# EAGLE design FreeVario F4 V1.2 (EAGLE 9.2.2)
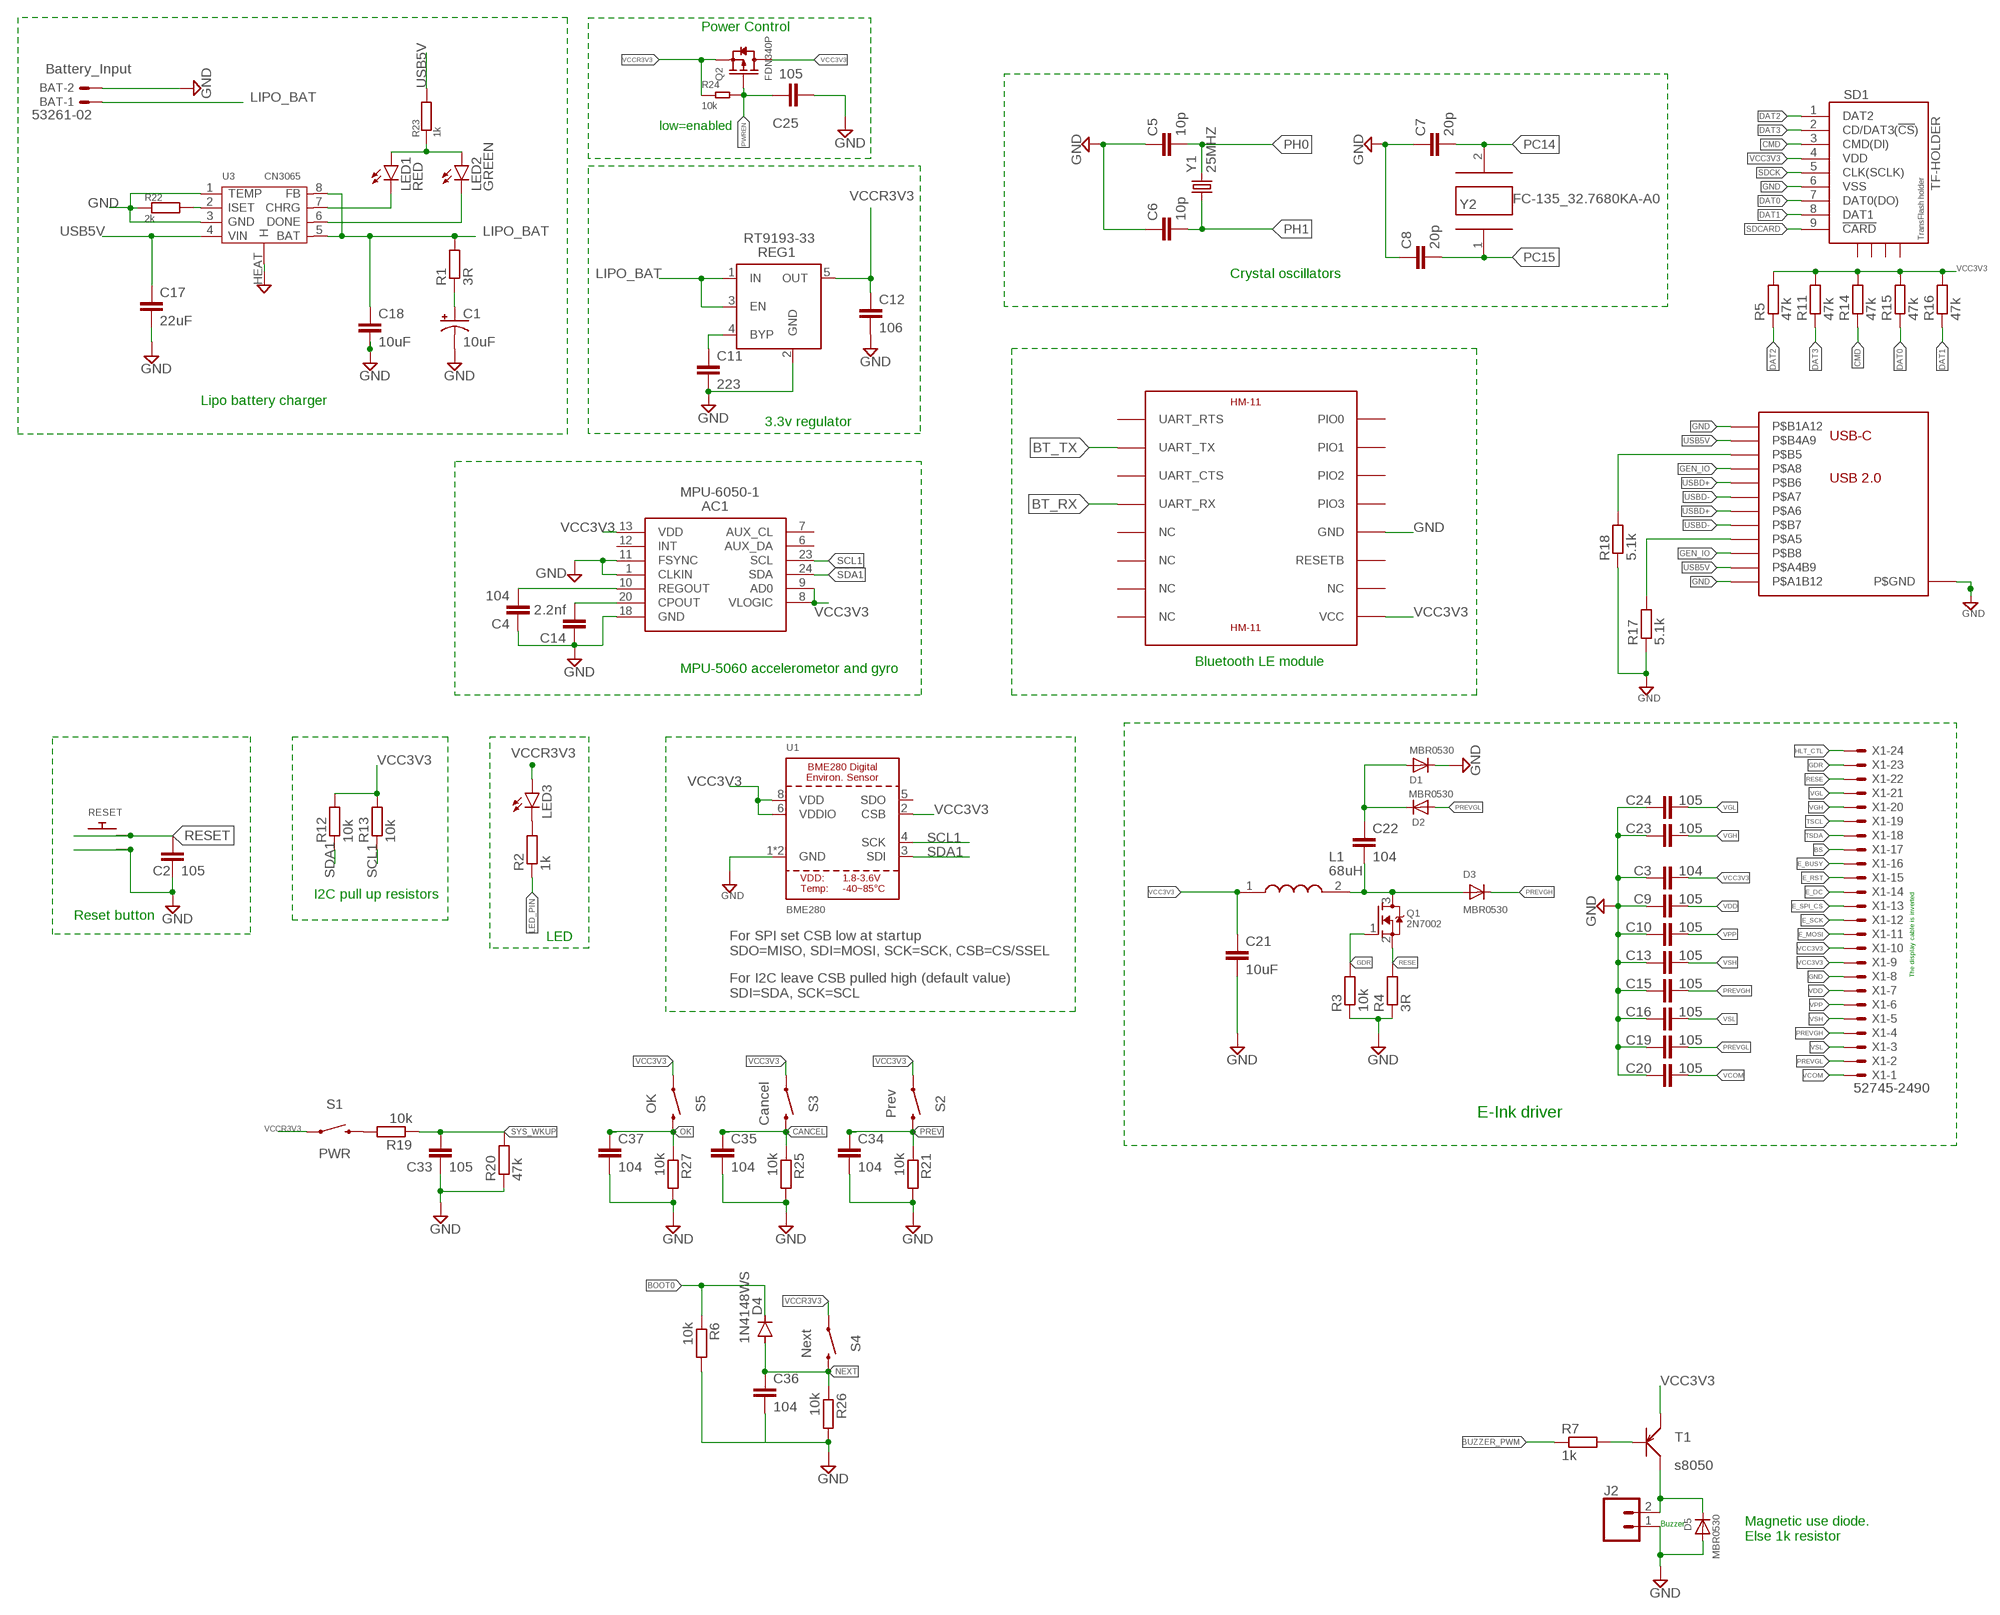
[diagram p0: schematic, sheet 1, part 1 of 2]
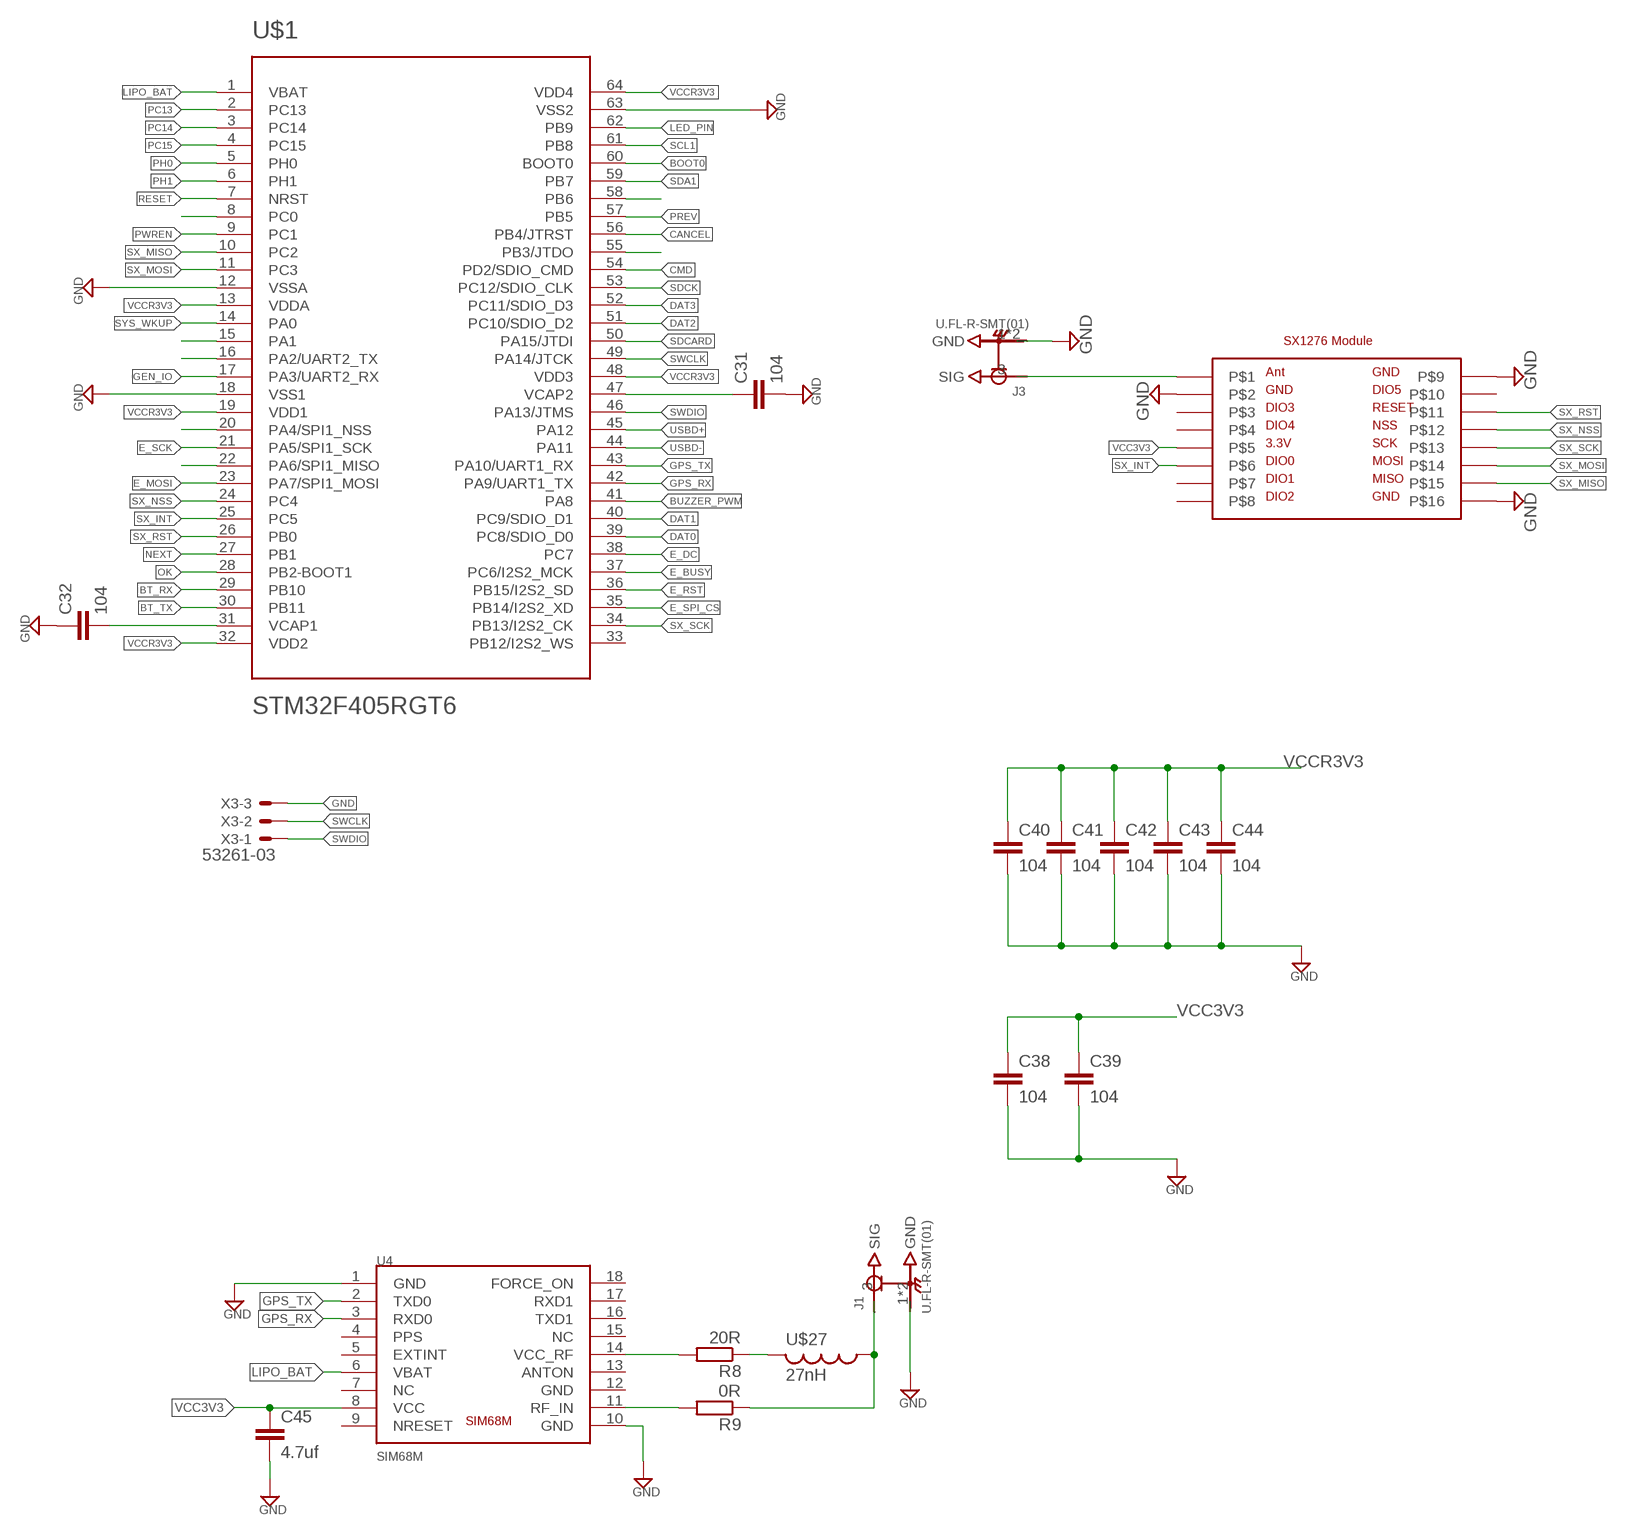
[diagram p1: schematic, sheet 1, part 2 of 2]

## Parts
AC1  MPU-6050-1  [QFN-24-4MM2]
BAT  53261-02  [53261-02]
C1  10uF  10UF-POLAR-EIA3216-16V-10%(TANT)  [EIA3216]
C2  105  C-EUC0603K  [C0603K]
C3  104  C-EUC0603K  [C0603K]
C4  104  C-EUC0603K  [C0603K]
C5  10p  C-EUC0603K  [C0603K]
C6  10p  C-EUC0603K  [C0603K]
C7  20p  C-EUC0603K  [C0603K]
C8  20p  C-EUC0603K  [C0603K]
C9  105  C-EUC0603K  [C0603K]
C10  105  C-EUC0603K  [C0603K]
C11  223  C-EUC0603K  [C0603K]
C12  106  C-EUC0603K  [C0603K]
C13  105  C-EUC0603K  [C0603K]
C14  2.2nf  C-EUC0603K  [C0603K]
C15  105  C-EUC0603K  [C0603K]
C16  105  C-EUC0603K  [C0603K]
C17  22uF  C-EUC0805  [C0805]
C18  10uF  C-EUC0805  [C0805]
C19  105  C-EUC0603K  [C0603K]
C20  105  C-EUC0603K  [C0603K]
C21  10uF  C-EUC0603K  [C0603K]
C22  104  C-EUC0603K  [C0603K]
C23  105  C-EUC0603K  [C0603K]
C24  105  C-EUC0603K  [C0603K]
C25  105  C-EUC0603K  [C0603K]
C31  104  C-EUC0603K  [C0603K]
C32  104  C-EUC0603K  [C0603K]
C33  105  C-EUC0603K  [C0603K]
C34  104  C-EUC0603K  [C0603K]
C35  104  C-EUC0603K  [C0603K]
C36  104  C-EUC0603K  [C0603K]
C37  104  C-EUC0603K  [C0603K]
C38  104  C-EUC0603K  [C0603K]
C39  104  C-EUC0603K  [C0603K]
C40  104  C-EUC0603K  [C0603K]
C41  104  C-EUC0603K  [C0603K]
C42  104  C-EUC0603K  [C0603K]
C43  104  C-EUC0603K  [C0603K]
C44  104  C-EUC0603K  [C0603K]
C45  4.7uf  C-EUC0603K  [C0603K]
D1  MBR0530  DIODESOD-123  [SOD-123]
D2  MBR0530  DIODESOD-123  [SOD-123]
D3  MBR0530  DIODESOD-123  [SOD-123]
D4  1N4148WS  DIODE-SOD323-R  [SOD323-R]
D5  MBR0530  DIODESOD-123  [SOD-123]
HM13  HM-11  [HM-11]
J1  U.FL-R-SMT(01)  [HRS_U.FL-R-SMT(01)]
J2  CONN_021X02_NO_SILK  [1X02_NO_SILK]
J3  U.FL-R-SMT(01)  [HRS_U.FL-R-SMT(01)]
L1  68uH  SWPA3015S2R2NT  [INDPM3030X150N]
LED1  RED  LEDCHIPLED_0603  [CHIPLED_0603]
LED2  GREEN  LEDCHIPLED_0603  [CHIPLED_0603]
LED3  LEDCHIP-LED0603  [CHIP-LED0603]
Q1  2N7002  MOSFET-NREFLOW  [SOT23]
Q2  FDN340P  MOSFET-P'SI2323CDS/SI2305DS<BR>'  [SOT-23]
R1  3R  R-EU_R0603  [R0603]
R2  1k  R-EU_R0603  [R0603]
R3  10k  R-EU_R0603  [R0603]
R4  3R  R-EU_R0603  [R0603]
R5  47k  R-EU_R0603  [R0603]
R6  10k  R-EU_R0603  [R0603]
R7  1k  R-EU_R0603  [R0603]
R8  20R  R-EU_R0603  [R0603]
R9  0R  R-EU_R0603  [R0603]
R11  47k  R-EU_R0603  [R0603]
R12  10k  R-EU_R0603  [R0603]
R13  10k  R-EU_R0603  [R0603]
R14  47k  R-EU_R0603  [R0603]
R15  47k  R-EU_R0603  [R0603]
R16  47k  R-EU_R0603  [R0603]
R17  5.1k  R-EU_R0603  [R0603]
R18  5.1k  R-EU_R0603  [R0603]
R19  10k  R-EU_R0603  [R0603]
R20  47k  R-EU_R0603  [R0603]
R21  10k  R-EU_R0603  [R0603]
R22  2k  R-EU_R0603  [R0603]
R23  1k  R-EU_R0603  [R0603]
R24  10k  RES-0603  [R0603]
R25  10k  R-EU_R0603  [R0603]
R26  10k  R-EU_R0603  [R0603]
R27  10k  R-EU_R0603  [R0603]
REG1  RT9193-33  MIC5219XX  [SOT23-5]
RESET  TS-015A  [TS-015A]
S1  PWR  MOMENTARY-SWITCH-SPST-SMD-6.0X3.5MM  [TACTILE_SWITCH_SMD_6.0X3.5MM]
S2  Prev  MOMENTARY-SWITCH-SPST-SMD-6.0X3.5MM  [TACTILE_SWITCH_SMD_6.0X3.5MM]
S3  Cancel  MOMENTARY-SWITCH-SPST-SMD-6.0X3.5MM  [TACTILE_SWITCH_SMD_6.0X3.5MM]
S4  Next  MOMENTARY-SWITCH-SPST-SMD-6.0X3.5MM  [TACTILE_SWITCH_SMD_6.0X3.5MM]
S5  OK  MOMENTARY-SWITCH-SPST-SMD-6.0X3.5MM  [TACTILE_SWITCH_SMD_6.0X3.5MM]
SD1  TF-HOLDER  [TF-PULL]
T1  s8050  SMD-TRANSISTORS-PNP-25V-500MA(SOT-23)  [SOT-23]
U1  BME280  [BME280]
U3  CN3065  PMIC-CN3065-DFN8  [DFN-8]
U4  SIM68M  [SIM68M]
U$1  STM32F405RGT6  STM32F405RG  [TQFP64]
U$2  USB-C_LOWSPEED  [USB-C_LOWSPEED]
U$4  MODULESX1276  [MODULESX1276]
U$27  27nH  INDUCTOR_0603_M  [RESC0603_M]
X1  52745-2490  [52745-2490]
X3  53261-03  [53261-03]
Y1  25MHZ  KX-9B  [5.0X3.2_2]
Y2  FC-135_32.7680KA-A0  [XTAL_FC-135_32.7680KA-A0]

## Nets
BOOT0: D4.C R6.1 U$1.60(BOOT0)
BS: X1.17
BT_RX: HM13.UART_RX U$1.29(PB10)
BT_TX: HM13.UART_TX U$1.30(PB11)
BUZZER_PWM: R7.1 U$1.41(PA8)
CANCEL: C35.1 R25.1 S3.2 U$1.56(PB4/JTRST)
CMD: R14.1 SD1.3(CMD(DI)) U$1.54(PD2/SDIO_CMD)
DAT0: R15.1 SD1.7(DAT0(DO)) U$1.39(PC8/SDIO_D0)
DAT1: R16.1 SD1.8(DAT1) U$1.40(PC9/SDIO_D1)
DAT2: R5.1 SD1.1(DAT2) U$1.51(PC10/SDIO_D2)
DAT3: R11.1 SD1.2(CD/DAT3(!CS!)) U$1.52(PC11/SDIO_D3)
E_BUSY: U$1.37(PC6/I2S2_MCK) X1.16
E_DC: U$1.38(PC7) X1.14
E_MOSI: U$1.23(PA7/SPI1_MOSI) X1.11
E_RST: U$1.36(PB15/I2S2_SD) X1.15
E_SCK: U$1.21(PA5/SPI1_SCK) X1.12
E_SPI_CS: U$1.35(PB14/I2S2_XD) X1.13
GDR: Q1.1(G) R3.2 X1.23
GEN_IO: U$1.17(PA3/UART2_RX) U$2.P$A8 U$2.P$B8
GND: AC1.1(CLKIN) AC1.11(FSYNC) AC1.18(GND) BAT.2 C1.- C2.2 C3.1 C4.1 C5.1 C6.1 C7.1 C8.1 C9.1 C10.1 C11.2 C12.2 C13.1 C14.1 C15.1 C16.1 C17.2 C18.2 C19.1 C20.1 C21.2 C23.1 C24.1 C25.2 C31.2 C32.1 C33.2 C34.2 C35.2 C36.2 C37.2 C38.2 C39.2 C40.2 C41.2 C42.2 C43.2 C44.2 C45.2 D1.C D5.A HM13.GND J1.1(GND) J1.2(GND) J2.1 J3.1(GND) J3.2(GND) R3.1 R4.1 R6.2 R17.1 R18.1 R20.1 R21.2 R22.1 R25.2 R26.2 R27.2 REG1.2(GND) RESET.P$2 RESET.P$4 SD1.6(VSS) U1.1(GND) U1.7(GND) U3.1(TEMP) U3.3(GND) U3.HEAT(H) U4.1(GND) U4.10(GND) U$1.12(VSSA) U$1.18(VSS1) U$1.63(VSS2) U$2.P$1(P$GND) U$2.P$2(P$GND) U$2.P$20(P$GND) U$2.P$21(P$GND) U$2.P$22(P$GND) U$2.P$23(P$GND) U$2.P$A1B12 U$2.P$B1A12 U$4.SX2 U$4.SX9 U$4.SX16 X1.8 X3.3
GPS_RX: U4.3(RXD0) U$1.42(PA9/UART1_TX)
GPS_TX: U4.2(TXD0) U$1.43(PA10/UART1_RX)
HLT_CTL: X1.24
LED_PIN: R2.1 U$1.62(PB9)
LIPO_BAT: BAT.1 C18.1 R1.2 REG1.1(IN) REG1.3(EN) U3.5(BAT) U3.8(FB) U4.6(VBAT) U$1.1(VBAT)
N$2: LED1.A LED2.A R23.1
N$3: LED1.C U3.7(CHRG)
N$4: LED2.C U3.6(DONE)
N$5: C1.+ R1.1
N$6: C11.1 REG1.4(BYP)
N$9: J1.3(SIG) R9.1 U$27.1
N$11: LED3.C R2.2
N$12: U$1.55(PB3/JTDO)
N$18: C22.2 D3.A L1.2 Q1.3(D)
N$21: U$1.16(PA2/UART2_TX)
N$22: R19.2 S1.2
N$23: R8.1 U$27.2
N$24: C22.1 D1.A D2.C
N$25: J3.3(SIG) U$4.SX1
N$26: D5.C J2.2 T1.3(C)
N$28: R7.2 T1.1(B)
N$30: AC1.10(REGOUT) C4.2
N$31: R8.2 U4.14(VCC_RF)
N$32: R22.2 U3.2(ISET)
N$33: AC1.20(CPOUT) C14.2
N$36: R9.2 U4.11(RF_IN)
N$39: U$1.15(PA1)
N$44: U$1.20(PA4/SPI1_NSS)
N$46: U$1.22(PA6/SPI1_MISO)
N$55: C32.2 U$1.31(VCAP1)
N$63: U$1.58(PB6)
N$74: C31.1 U$1.47(VCAP2)
N$93: R17.2 U$2.P$A5
N$99: R18.2 U$2.P$B5
NEXT: C36.1 D4.A R26.1 S4.2 U$1.27(PB1)
OK: C37.1 R27.1 S5.2 U$1.28(PB2-BOOT1)
PC0: U$1.8(PC0)
PC13: U$1.2(PC13)
PC14: C7.2 U$1.3(PC14) Y2.2
PC15: C8.2 U$1.4(PC15) Y2.1
PH0: C5.2 U$1.5(PH0) Y1.2
PH1: C6.2 U$1.6(PH1) Y1.1
PREV: C34.1 R21.1 S2.2 U$1.57(PB5)
PREVGH: C15.2 D3.C X1.4
PREVGL: C19.2 D2.A X1.2
PWREN: C25.1 Q2.1(G) R24.2 U$1.9(PC1)
RESE: Q1.2(S) R4.2 X1.22
RESET: C2.1 RESET.P$1 RESET.P$3 U$1.7(NRST)
SCL1: AC1.23(SCL) R13.1 U1.4(SCK) U$1.61(PB8)
SDA1: AC1.24(SDA) R12.1 U1.3(SDI) U$1.59(PB7)
SDCARD: SD1.9(!CARD) U$1.50(PA15/JTDI)
SDCK: SD1.5(CLK(SCLK)) U$1.53(PC12/SDIO_CLK)
SWCLK: U$1.49(PA14/JTCK) X3.2
SWDIO: U$1.46(PA13/JTMS) X3.1
SX_INT: U$1.25(PC5) U$4.SX6
SX_MISO: U$1.10(PC2) U$4.SX15
SX_MOSI: U$1.11(PC3) U$4.SX14
SX_NSS: U$1.24(PC4) U$4.SX12
SX_RST: U$1.26(PB0) U$4.SX11
SX_SCK: U$1.34(PB13/I2S2_CK) U$4.SX13
SYS_WKUP: C33.1 R19.1 R20.2 U$1.14(PA0)
TSCL: X1.19
TSDA: X1.18
USB5V: C17.1 R23.2 U3.4(VIN) U$2.P$A4B9 U$2.P$B4A9
USBD+: U$1.45(PA12) U$2.P$A6 U$2.P$B6
USBD-: U$1.44(PA11) U$2.P$A7 U$2.P$B7
VCC3V3: AC1.8(VLOGIC) AC1.9(AD0) AC1.13(VDD) C3.2 C21.1 C38.1 C39.1 C45.1 HM13.VCC L1.1 Q2.3(D) R5.2 R11.2 R12.2 R13.2 R14.2 R15.2 R16.2 S2.1 S3.1 S5.1 SD1.4(VDD) T1.2(E) U1.2(CSB) U1.6(VDDIO) U1.8(VDD) U4.8(VCC) U$4.SX5 X1.9 X1.10
VCCR3V3: C12.1 C40.1 C41.1 C42.1 C43.1 C44.1 LED3.A Q2.2(S) R24.1 REG1.5(OUT) S1.1 S4.1 U$1.13(VDDA) U$1.19(VDD1) U$1.32(VDD2) U$1.48(VDD3) U$1.64(VDD4)
VCOM: C20.2 X1.1
VDD: C9.2 X1.7
VGH: C23.2 X1.20
VGL: C24.2 X1.21
VPP: C10.2 X1.6
VSH: C13.2 X1.5
VSL: C16.2 X1.3
Unconnected: AC1.6(AUX_DA) AC1.7(AUX_CL) AC1.12(INT) HM13.NC@5(NC) HM13.NC@6(NC) HM13.NC@7(NC) HM13.NC@8(NC) HM13.NC@10(NC) HM13.PIO0 HM13.PIO1 HM13.PIO2 HM13.PIO3 HM13.RESETB HM13.UART_CTS HM13.UART_RTS SD1.S1 SD1.S2 SD1.S3 SD1.S4 U1.5(SDO) U4.4(PPS) U4.5(EXTINT) U4.7(NC) U4.9(NRESET) U4.13(ANTON) U4.15(NC) U4.16(TXD1) U4.17(RXD1) U4.18(FORCE_ON) U$1.33(PB12/I2S2_WS) U$4.SX3 U$4.SX4 U$4.SX7 U$4.SX8 U$4.SX10

## Notes on the sheet
- Power Control
- Battery_Input
- low=enabled
- Crystal oscillators
- Lipo battery charger
- 3.3v regulator
- Bluetooth LE module
- MPU-5060 accelerometor and gyro
- The display cable is inverted
- I2C pull up resistors
- Reset button
- LED
- For SPI set CSB low at startup
  SDO=MISO, SDI=MOSI, SCK=SCK, CSB=CS/SSEL
- For I2C leave CSB pulled high (default value)
  SDI=SDA, SCK=SCL
- E-Ink driver
- Buzzer
- Magnetic use diode.
  Else 1k resistor

## Power pins joined to a net without a drawn wire
GND: U4.12(GND)

## Library data of the parts
AC1 = mpu5060:MPU-6050
BAT = con-molex:53?-02: CONNECTOR wire to board 1.25 mm (.049 inch) pitch header; MF: MOLEX; OC_FARNELL: 1125373; OC_NEWARK: unknown
C1 = SparkFun-Capacitors:10UF-POLAR: 10.0µF polarized capacitors A capacitor is a passive two-terminal electrical component used to store electrical energy temporarily in an electric field.; PROD_ID: CAP-00811
C2-C25 C31-C45 = rcl:C-EU: CAPACITOR, European symbol; SPICEPREFIX: C
D1-D3 D5 = adafruit:DIODE: Diode SMADIODE - SMA Surface Mount Package 20V 1A Schottky Diode Digikey: 641-1014-6-ND DO-1N4148 - Through Hole Small Current Diode SOD-123 20V 1 A (.5mV Vf) Schottky Diode - Digikey: MBRX120TPMSCT-ND SOD-323 10V 570mA (.38mV Vf, 3ns) Schottky Diode - Digikey: ZLLS410CT-ND SOD-523 30V 30mA Schottky Diode (RB751S-40TE61) - Digikey: RB751S-40TE61CT-ND SOT23-R/W - SOT23 Package (R = Solder Paste/Reflow Ovens, W = Hand-Soldering) BAT54Film 40V 300mA - Digikey: 497-7162-1-ND
D4 = diode:DIODE-: DIODE
HM13 = hm-11:HM-11: JNHuaMao HM-11 Bluetooth 4.0 Transceiver based on TI CC2540/CC2541
J1 J3 = U.FL-R-SMT_01_:U.FL-R-SMT(01): U.FL Series 6 Ghz 50 Ohm Ultra-small SMT Coaxial Cable Receptacle; AVAILABILITY: Good; DESCRIPTION: U.FL Series 6 Ghz 50 Ohm Ultra-small SMT Coaxial Cable Receptacle; MF: Hirose; MP: U.FL-R-SMT(01); PACKAGE: None; PRICE: 0.85 USD
J2 = SparkFun-Connectors:CONN_02: Multi connection point. Often used as Generic Header-pin footprint for 0.1 inch spaced/style header connections On any of the 0.1 inch spaced packages, you can populate with these: Break Away Headers - Straight <https://www.sparkfun.com/products/116> (PRT-00116) Break Away Male Headers - Right Angle <https://www.sparkfun.com/products/553> (PRT-00553) Female Headers <https://www.sparkfun.com/products/115> (PRT-00115) Break Away Headers - Machine Pin <https://www.sparkfun.com/products/117> (PRT-00117) Break Away Female Headers - Swiss Machine Pin <https://www.sparkfun.com/products/743> (PRT-00743) For SCREWTERMINALS and SPRING TERMINALS visit here: Screw Terimnals on SparkFun.com <https://www.sparkfun.com/search/results?term=Screw+Terminals> (5mm/3.5mm/2.54mm spacing) This device is also useful as a general connection point to wire up your design to another part of your project. Our various solder wires solder well into these plated through hole pads. Hook-Up Wire - Assortment (Stranded, 22 AWG) <https://www.sparkfun.com/products/11375> (PRT-11375) Hook-Up Wire - Assortment (Solid Core, 22 AWG) <https://www.sparkfun.com/products/11367> (PRT-11367) View the entire wire category on our website here <https://www.sparkfun.com/categories/141> Special notes: Molex polarized connector foot print use with: PRT-08233 with associated crimp pins and housings. 2.54_SCREWTERM for use with PRT-10571. 3.5mm Screw Terminal footprints for PRT-08084 5mm Screw Terminal footprints for use with PRT-08432
L1 = SWPA3015S2R2NT:SWPA3015S2R2NT: Wire Wound SMD Power Inductor Source: Datasheet <https://www.datasheets360.com/pdf/-6416416511052712578>; DESCRIPTION: Wire Wound SMD Power Inductor; HEIGHT: 1.5mm; MANUFACTURER_NAME: SUNLORD; MANUFACTURER_PART_NUMBER: SWPA3015S2R2NT
LED1-LED3 = led:LED: LED OSRAM: - CHIPLED LG R971, LG N971, LY N971, LG Q971, LY Q971, LO R971, LY R971 LH N974, LH R974 LS Q976, LO Q976, LY Q976 LO Q996 - Hyper CHIPLED LW Q18S LB Q993, LB Q99A, LB R99A - SideLED LS A670, LO A670, LY A670, LG A670, LP A670 LB A673, LV A673, LT A673, LW A673 LH A674 LY A675 LS A676, LA A676, LO A676, LY A676, LW A676 LS A679, LY A679, LG A679 - Hyper Micro SIDELED® LS Y876, LA Y876, LO Y876, LY Y876 LT Y87S - SmartLED LW L88C, LW L88S LB L89C, LB L89S, LG L890 LS L89K, LO L89K, LY L89K LS L896, LA L896, LO L896, LY L896 - TOPLED LS T670, LO T670, LY T670, LG T670, LP T670 LSG T670, LSP T670, LSY T670, LOP T670, LYG T670 LG T671, LOG T671, LSG T671 LB T673, LV T673, LT T673, LW T673 LH T674 LS T676, LA T676, LO T676, LY T676, LB T676, LH T676, LSB T676, LW T676 LB T67C, LV T67C, LT T67C, LS T67K, LO T67K, LY T67K, LW E67C LS E67B, LA E67B, LO E67B, LY E67B, LB E67C, LV E67C, LT E67C LW T67C LS T679, LY T679, LG T679 LS T770, LO T770, LY T770, LG T770, LP T770 LB T773, LV T773, LT T773, LW T773 LH T774 LS E675, LA E675, LY E675, LS T675 LS T776, LA T776, LO T776, LY T776, LB T776 LHGB T686 LT T68C, LB T68C - Hyper Mini TOPLED® LB M676 - Mini TOPLED Santana® LG M470 LS M47K, LO M47K, LY M47K Source: http://www.osram.convergy.de LUXEON: - LUMILED® LXK2-PW12-R00, LXK2-PW12-S00, LXK2-PW14-U00, LXK2-PW14-V00 LXK2-PM12-R00, LXK2-PM12-S00, LXK2-PM14-U00 LXK2-PE12-Q00, LXK2-PE12-R00, LXK2-PE12-S00, LXK2-PE14-T00, LXK2-PE14-U00 LXK2-PB12-K00, LXK2-PB12-L00, LXK2-PB12-M00, LXK2-PB14-N00, LXK2-PB14-P00, LXK2-PB14-Q00 LXK2-PR12-L00, LXK2-PR12-M00, LXK2-PR14-Q00, LXK2-PR14-R00 LXK2-PD12-Q00, LXK2-PD12-R00, LXK2-PD12-S00 LXK2-PH12-R00, LXK2-PH12-S00 LXK2-PL12-P00, LXK2-PL12-Q00, LXK2-PL12-R00 Source: www.luxeon.com KINGBRIGHT: KA-3528ASYC Source: www.kingbright.com
Q1 = adafruit:MOSFET-N: N-Channel Mosfet 2N7002E - 60V 260mA SOT23 [Digikey: 2N7002ET1GOSTR-ND] - REEL BSH103 - 30V 850mA SOT23 [Digikey: 568-5013-1-ND]
Q2 = Discrete-new:MOSFET-P
R1 R7 R22 R23 = resistor:R-EU_: RESISTOR, European symbol
R2-R6 R8 R9 R11-R21 R25-R27 = rcl:R-EU_: RESISTOR, European symbol; SPICEPREFIX: R
R24 = Discrete-new:RES
REG1 = v-reg-micrel:MIC5219XX: VOLTAGE REGULATOR; OC_FARNELL: unknown; OC_NEWARK: unknown
RESET = ts-015a switch:TS-015A: TS-15A
S1-S5 = SparkFun-Switches:MOMENTARY-SWITCH-SPST: Momentary Switch (Pushbutton) - SPST Normally-open (NO) SPST momentary switches (buttons, pushbuttons). Variants PTH-12MM - 12mm square, through-hole Momentary Pushbutton Switch - 12mm Square <https://www.sparkfun.com/products/9190> (COM-09190) PTH-6.0MM, PTH-6.0MM-KIT - 6.0mm square, through-hole Mini Pushbutton Switch <https://www.sparkfun.com/products/97> (COM-00097) KIT package intended for soldering kit's - only one side of pads' copper is exposed. PTH-RIGHT-ANGLE-KIT - Right-angle, through-hole Right Angle Tactile Button <https://www.sparkfun.com/products/10791> - Used on SparkFun BigTime Watch Kit <https://www.sparkfun.com/products/11734> SMD-12MM - 12mm square, surface-mount Tactile Button - SMD (12mm) <https://www.sparkfun.com/products/12993> (COM-12993) Used on SparkFun PicoBoard <https://www.sparkfun.com/products/11888> SMD-4.5MM - 4.5mm Square Trackball Switch Used on SparkFun Blackberry Trackballer Breakout <https://www.sparkfun.com/products/13169> SMD-4.6MMX2.8MM - 4.60mm x 2.80mm, surface mount Used on SparkFun SAMD21 Mini Breakout <https://www.sparkfun.com/products/13664> SMD-5.2MM, SMD-5.2-REDUNDANT - 5.2mm square, surface-mount Mini Pushbutton Switch - SMD <https://www.sparkfun.com/products/8720> (COM-08720) Used on Arduino Pro Mini <https://www.sparkfun.com/products/11114> REDUNDANT package connects both switch circuits together SMD-6.0X3.5MM - 6.0 x 3.5mm, surface mount Momentary Reset Switch SMD <https://www.sparkfun.com/products/8229> (COM-08229) SMD-6.2MM-TALL - 6.2mm square, surface mount Tactile Button - SMD (6mm) <https://www.sparkfun.com/products/12992> Used on SparkFun Digital Sandbox <https://www.sparkfun.com/products/12651> SMD-RIGHT-ANGLE - Right-angle, surface mount Used on SparkFun Block for Intel® Edison - Arduino <https://www.sparkfun.com/products/13036>; PROD_ID: SWCH-00815; SF_SKU: COM-08229
SD1 = sd-mmc:TF-HOLDER: TF / Micro SD socket is PUSH-PUSH type, the card can be pushed into and auto locked and pushed out by simply press the card. Surface Mounting type.
T1 = SMD-TRANSISTORS-PNP-25V-500MA_SOT-23_:SMD-TRANSISTORS-PNP-25V-500MA(SOT-23): 305020006; AVAILABILITY: Unavailable; DESCRIPTION: SMD Transistors PNP 25V 500mA; MF: Seeed Studio; MP: S8550; PACKAGE: None; PRICE: None
U1 = microbuilder:BME280: BME280 - Environmental Sensor (I2C + SPI)
U3 = IC-new:PMIC-CN3065: 310030101
U4 = electronic-labs:SIM68M
U$1 = SparkFun-IC-Microcontroller:STM32F405RG: STM32F405RGT6 ARM DSP Chip used on the WAV Trigger board. IC MCU 32BIT 1MB FLASH 64LQFP Datasheet <https://cdn.sparkfun.com/datasheets/Widgets/STM32F405RGT6.pdf> SparkFun Products WAV Trigger <https://www.sparkfun.com/products/13660> (WIG-13660); PROD_ID: IC-11709
U$2 = Mvz_USBClowspeed:USB-C_LOWSPEED: USB C Female connctor. Only uses the USB 2.0 data ports
U$4 = Mvz_module SX1276:MODULESX1276: Module SX1276 LORA modem
U$27 = Nordic_nRF:INDUCTOR: Generic chip inductor
X1 = con-molex:52745-2490: FFC/FPC-to-Board 0.50mm (.020") SMT Top Contact Right Angle, ZIF, Style Receptacle 52745 / 52435 Source: http://www.molex.com/product/ffc/52745.html; MF: MOLEX; OC_FARNELL: unknown; OC_NEWARK: unknown
X3 = con-molex:53?-03: CONNECTOR wire to board 1.25 mm (.049 inch) pitch header; MF: MOLEX; MPN: 53261-0390; OC_FARNELL: 1125359; OC_NEWARK: 57H5006
Y1 = crystal-geyer_V1_0:KX: Quartz Crystals (MHz) SMD: KX - Serie Model Size l/w/h [mm] Frequency Range Frequency Stability Temp. Range [°C] Load Capacitance AECQ 200 availabel Datasheet KX-4 KX-5 KX-6 KX-7 KX-9A KX-9B KX-12A KX-12B KX-13 KX-20 KX-K KX-KS 1.6/1.2/0.3 2.0/1.6/0.45 2.5/2.0/0.55 3.2/2.5/0.8 5.0/3.2/1.0 5.0/3.2/1.1 6.0/3.5/1.1 6.0/3.5/1.0 7.0/5.0 /1.3 11.6/5.5/1.6 12.3/4.5/4.2 12.3/4.5/3.2 24.0 ~ 80.0 MHz 16.0 ~ 80.0 MHz 12.0 ~ 80.0 MHz 8.0 ~ 60.0 MHz 7,68 ~ 300,0 MHz 8,0 ~ 50,0 MHz 8,0 ~ 150,0 MHz 8,0 ~ 50,0 MHz 6,0 ~ 160,0 MHz 3,579 ~ 25,0 MHz 3,579 ~ 70,0 MHz 3,579 ~ 70,0 MHz ±10 … ±50ppm ±10 … ±50ppm ±10 … ±50ppm ±10 … ±50ppm ±10 … ±50ppm ±10 … ±50ppm ±10 … ±50ppm ±10 … ±50ppm ±10 … ±50ppm ±50ppm ±10 … ±50ppm ±10 … ±50ppm (*) -40°C …+85°C (*) -40°C …+125°C (*) -40°C …+125°C (*) -40°C …+125°C (*) -40°C …+105°C (*) -40°C …+105°C (*) -40°C …+125°C (*) -40°C …+105°C (*) -40°C …+105°C (*) -40°C …+105°C (*) -40°C …+85°C (*) -40°C …+85°C 8, 8…16 8, 8…16 10, 8…16 12, 7…20 16, 10…20 16, 10…20 16, 10…20 16, 12…20 16, 12…20 16, 12…20 16, 12…30 16, 12…30 - yes yes yes - - - - - - - - KX-4.pdf <http://www.geyer-electronic.de/uploads/tx_userartikelfrequenz/GEYER-KX-4.pdf> KX-5.pdf <http://www.geyer-electronic.de/uploads/tx_userartikelfrequenz/GEYER-KX-5.pdf> KX-6.pdf <http://www.geyer-electronic.de/uploads/tx_userartikelfrequenz/GEYER-KX-6.pdf> KX-7.pdf <http://www.geyer-electronic.de/uploads/tx_userartikelfrequenz/GEYER-KX-7.pdf> KX-9A.pdf <http://www.geyer-electronic.de/uploads/tx_userartikelfrequenz/GEYER-KX-9A.pdf> KX-9B.pdf <http://www.geyer-electronic.de/uploads/tx_userartikelfrequenz/GEYER-KX-9B.pdf> KX-12A.pdf <http://www.geyer-electronic.de/uploads/tx_userartikelfrequenz/GEYER-KX-12A.pdf> KX-12B.pdf <http://www.geyer-electronic.de/uploads/tx_userartikelfrequenz/GEYER-KX-12B.pdf> KX-13.pdf <http://www.geyer-electronic.de/uploads/tx_userartikelfrequenz/GEYER-KX-13.pdf> KX-20.pdf <http://www.geyer-electronic.de/uploads/tx_userartikelfrequenz/GEYER-KX-20.pdf> KX-K.pdf <http://www.geyer-electronic.de/uploads/tx_userartikelfrequenz/GEYER-KX-K.pdf> KX-KS.pdf <http://www.geyer-electronic.de/uploads/tx_userartikelfrequenz/GEYER-KX-KS.pdf> <http://www.geyer-electronic.de/fileadmin/template/img/logo-geyer-electronic.png> Details see: http://www.geyer-electronic.de/Frequenz-Produkte.9.0.html Created 2016-06-07, Hans Locher 2016 (C) Geyer Quartz Technology KX4,KX5,KX6,KX7,KX9A,KX9B,KX12A,KX12B,KX13,KX20,KXK,KXKS;1612;2016;2520;3225;5032;6035;7050;11655;12345;1,6x1,2;2,0x1,6;2,5x2,0;3,2x2,5;5,0x3,2;6,0x3,5;7,0x5,0;11,6x5,5;12,3x4,5;12,3x4,5;1.6x1.2;2.0x1.6;2.5x2.0;3.2x2.5;5.0x3.2;6.0x3.5;7.0x5.0;11.6x5.5;12.3x4.5;12.3x4.5;
Y2 = FC-135_32.7680KA-A0:FC-135_32.7680KA-A0: None; AVAILABILITY: Unavailable; DESCRIPTION: 32.7680 Khz 20ppm 12.5pf; MF: EPSON; MP: FC-135 32.7680KA-A0; PACKAGE: SMD-2 Epson; PRICE: None

## Net classes
0 default: clearance 0.205 mm

## Board
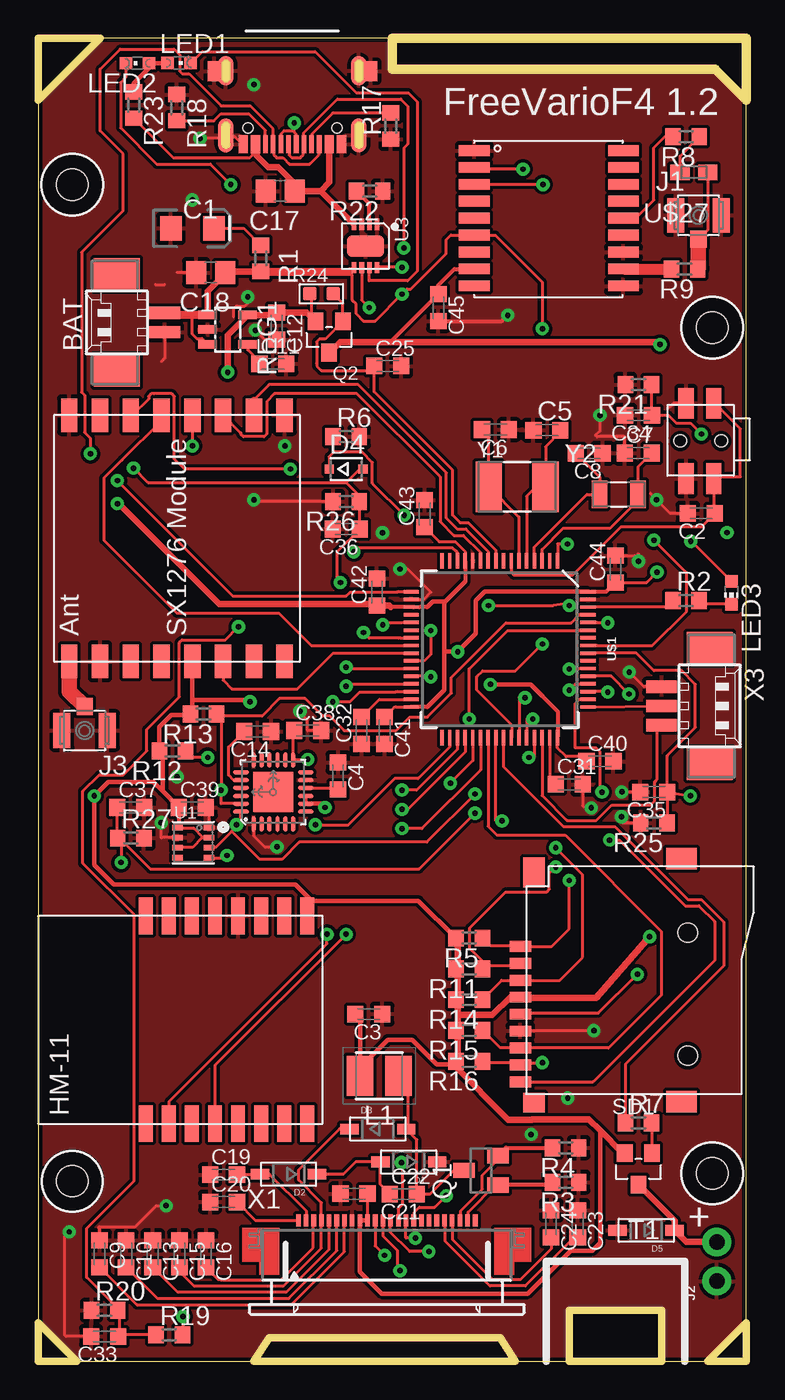
[diagram p2: board, top side]
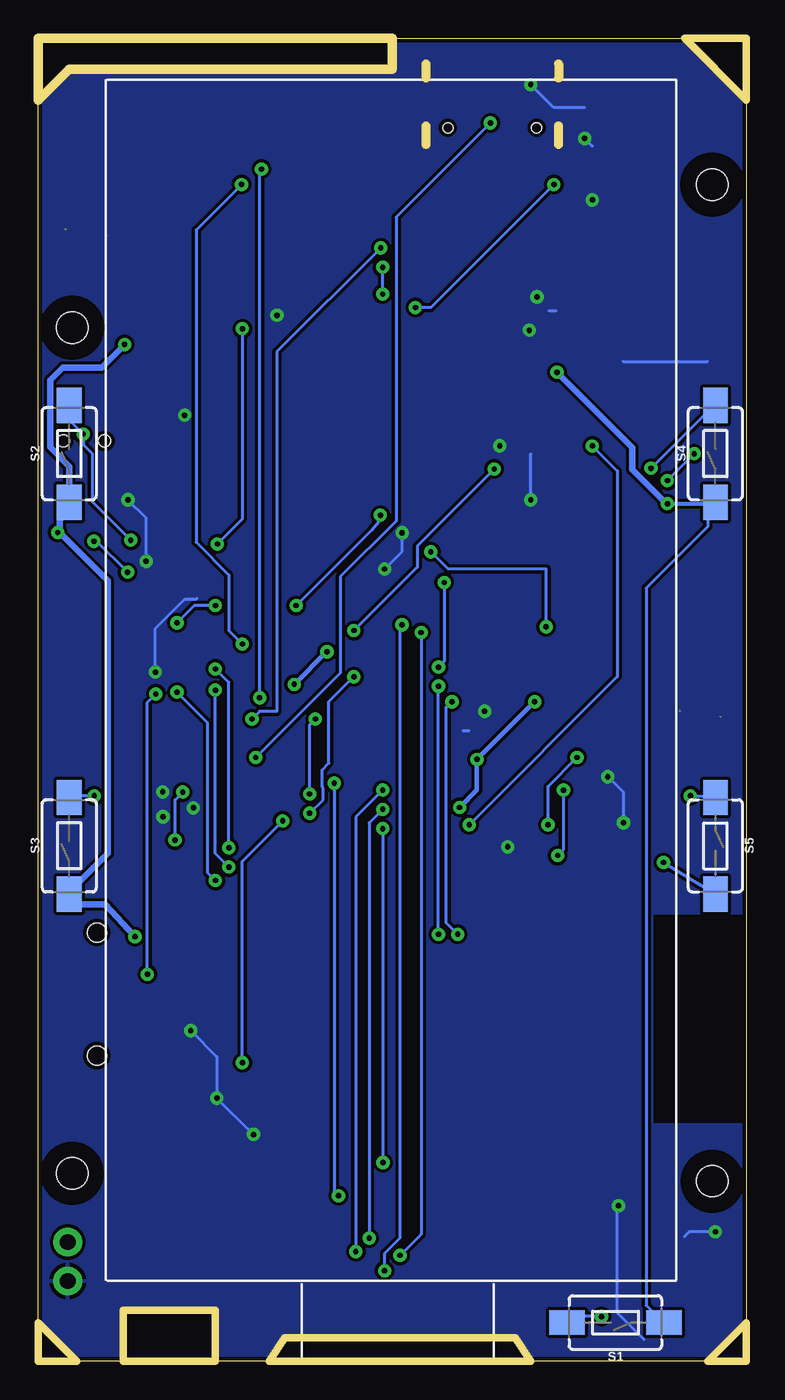
[diagram p3: board, bottom side, seen from below]

Size 46 x 86 mm. Coordinates in mm from the lower left corner, seen from the top.
Outline: 0,0 46,0 46,86 0,86 0,0
Copper layers (1*16): Top 0.035mm / dielectric 1.5mm / Bottom 0.035mm
Design rules "SparkFun": minimum track width 8mil, minimum drill 20mil, track to track 8mil, track to pad 8mil, pad to pad 8mil, via to via 8mil, smd to smd 8mil, copper to edge 10mil, drill to drill 8mil, minimum pad ring 12mil, minimum via ring 10mil, stop-mask expansion 4mil, vias tented up to drill 25mil, thermal gap 10mil
Holes 2.03 mm at 43.8,67.2 2.2,11.7 43.8,12.2 2.2,76.5
tRestrict: area 0.2,9.7 to 4.2,13.7; area 0,15.5 to 6,29; area 41.8,10.2 to 45.8,14.2; area 41.8,65.2 to 45.8,69.2; area 0.2,74.5 to 4.2,78.5; 13 lines
bRestrict: area 0,15.5 to 6,29; area 0.2,9.7 to 4.2,13.7; area 41.8,10.2 to 45.8,14.2; area 0.2,9.7 to 4.2,13.7; area 41.8,65.2 to 45.8,69.2; area 0.2,74.5 to 4.2,78.5; 12 lines
Milling: 22 lines

### Footprints (pad centres in the part's own frame; a part is rotated, then mirrored left to right if it is on the bottom)
QFN-24-4MM2 = smd 1.016 x 0.254: 1 -2.066,1.257; 2 -2.066,0.75; 3 -2.066,0.247; 4 -2.066,-0.287; 5 -2.066,-0.792; 6 -2.066,-1.297; 13 2.086,-1.297; 14 2.086,-0.792; 15 2.086,-0.287; 16 2.086,0.247; 17 2.086,0.75; 18 2.086,1.257 | smd 0.254 x 1.016: 7 -1.267,-2.122; 8 -0.762,-2.122; 9 -0.258,-2.122; 10 0.278,-2.122; 11 0.78,-2.122; 12 1.287,-2.122; 19 1.287,2.082; 20 0.78,2.082; 21 0.278,2.082; 22 -0.258,2.082; 23 -0.762,2.082; 24 -1.267,2.082 | smd 2.616 x 2.616: P$1 0.02,-0.01
53261-02 = smd 0.8 x 2: 1 0.625,-2.5; 2 -0.625,-2.5 | smd 2.1 x 3: S1 3.125,0.625; S2 -3.125,0.625
EIA3216 = smd 1.4 x 1.6: + 1.4,0; - -1.4,0
C0603K = smd 1.05 x 1.08: 1 -0.875,0; 2 0.875,0
C0805 = smd 1.3 x 1.5: 1 -0.95,0; 2 0.95,0
SOD-123 = smd 1.2 x 0.7: A 1.85,0; C -1.85,0
SOD323-R = smd 0.6 x 0.6: A 1.1,0; C -1.1,0
HM-11 = smd 2.4 x 0.9: GND 6.5,0; NC@5 -7,0; NC@6 -7,-1.5; NC@7 -7,-3; NC@8 -7,-4.5; NC@10 6.5,-3; PIO0 6.5,6; PIO1 6.5,4.5; PIO2 6.5,3; PIO3 6.5,1.5; RESETB 6.5,-1.5; UART_CTS -7,3; UART_RTS -7,6; UART_RX -7,1.5; UART_TX -7,4.5; VCC 6.5,-4.5
HRS_U.FL-R-SMT(01) = smd 1.1 x 2.25: 1 -1.475,0; 2 1.475,0 | smd 1.05 x 1.1: 3 0,-1.55
1X02_NO_SILK = drill 1.016 pad 1.88: 1 0,0; 2 2.54,0
INDPM3030X150N = smd 1.7 x 2.6: 1 -1.25,0; 2 1.25,0
CHIPLED_0603 = smd 0.8 x 0.8: A 0,-0.75; C 0,0.75
CHIP-LED0603 = smd 0.8 x 0.8: A 0,-0.75; C 0,0.75
SOT23 = smd 1 x 1.4: 1 -0.95,-1.1; 2 0.95,-1.1; 3 0,1.1
SOT-23 = smd 1.016 x 1.143: 1 -0.889,-1.016; 2 0.889,-1.016; 3 0,1.016
R0603 = smd 1 x 1.1: 1 -0.85,0; 2 0.85,0
R0603' = smd 0.889 x 0.889: 1 -0.762,0; 2 0.762,0
SOT23-5 = smd 0.55 x 1.2: 1 -0.95,-1.3; 2 0,-1.3; 3 0.95,-1.3; 4 0.95,1.3; 5 -0.95,1.3
TS-015A = smd 2 x 1: P$1 1,0.5; P$2 1,2.3; P$3 5.9,0.5; P$4 5.9,2.3 | hole 0.8: 3.45,2.68; 3.45,0
TACTILE_SWITCH_SMD_6.0X3.5MM = smd 2.3 x 1.6: 1 -3.15,0; 2 3.15,0
TF-PULL = smd 0.7 x 1.4: 1 -2.2,-7.62; 2 -1.1,-7.62; 3 0,-7.62; 4 1.1,-7.62; 5 2.2,-7.62; 6 3.3,-7.62; 7 4.4,-7.62; 8 5.5,-7.62; 9 6.6,-7.62 | smd 1.4 x 2: S1 -7.9,2.85; S2 7.9,2.85 | smd 1.28 x 1.4: S3 7.96,-6.75 | smd 1.95 x 1.4: S4 -7.025,-6.75 | hole 1.25: -3.1,3.25; 4.9,3.25
BME280 = smd 0.7 x 0.35: 1 1.025,0.975; 2 1.025,0.325; 3 1.025,-0.325; 4 1.025,-0.975; 5 -1.025,-0.975; 6 -1.025,-0.325; 7 -1.025,0.325; 8 -1.025,0.975
DFN-8 = smd 0.3 x 0.727: 1 -0.75,-1.413; 2 -0.25,-1.413; 3 0.25,-1.413; 4 0.75,-1.413; 5 0.75,1.413; 6 0.25,1.413; 7 -0.25,1.413; 8 -0.75,1.413 | smd 2.413 x 1.397: HEAT 0,0
SIM68M = smd 2 x 0.7: 1 -5.08,3.81; 2 -5.08,2.71; 3 -5.08,1.61; 4 -5.08,0.51; 5 -5.08,-0.59; 6 -5.08,-1.69; 7 -5.08,-2.79; 8 -5.08,-3.89; 9 -5.08,-4.99; 10 4.62,-4.99; 11 4.62,-3.89; 12 4.62,-2.79; 13 4.62,-1.69; 14 4.62,-0.59; 15 4.62,0.51; 16 4.62,1.61; 17 4.62,2.71; 18 4.62,3.81
TQFP64 = smd 0.22 x 1: 1 -3.75,-5.75; 2 -3.25,-5.75; 3 -2.75,-5.75; 4 -2.25,-5.75; 5 -1.75,-5.75; 6 -1.25,-5.75; 7 -0.75,-5.75; 8 -0.25,-5.75; 9 0.25,-5.75; 10 0.75,-5.75; 11 1.25,-5.75; 12 1.75,-5.75; 13 2.25,-5.75; 14 2.75,-5.75; 15 3.25,-5.75; 16 3.75,-5.75; 33 3.75,5.75; 34 3.25,5.75; 35 2.75,5.75; 36 2.25,5.75; 37 1.75,5.75; 38 1.25,5.75; 39 0.75,5.75; 40 0.25,5.75; 41 -0.25,5.75; 42 -0.75,5.75; 43 -1.25,5.75; 44 -1.75,5.75; 45 -2.25,5.75; 46 -2.75,5.75; 47 -3.25,5.75; 48 -3.75,5.75 | smd 1 x 0.22: 17 5.75,-3.75; 18 5.75,-3.25; 19 5.75,-2.75; 20 5.75,-2.25; 21 5.75,-1.75; 22 5.75,-1.25; 23 5.75,-0.75; 24 5.75,-0.25; 25 5.75,0.25; 26 5.75,0.75; 27 5.75,1.25; 28 5.75,1.75; 29 5.75,2.25; 30 5.75,2.75; 31 5.75,3.25; 32 5.75,3.75; 49 -5.75,3.75; 50 -5.75,3.25; 51 -5.75,2.75; 52 -5.75,2.25; 53 -5.75,1.75; 54 -5.75,1.25; 55 -5.75,0.75; 56 -5.75,0.25; 57 -5.75,-0.25; 58 -5.75,-0.75; 59 -5.75,-1.25; 60 -5.75,-1.75; 61 -5.75,-2.25; 62 -5.75,-2.75; 63 -5.75,-3.25; 64 -5.75,-3.75
USB-C_LOWSPEED = smd 0.889 x 1.27: P$1 5.08,-3.683; P$2 -5.08,-3.683 | smd 1 x 2.2: P$20 4.32,0.5; P$23 -4.32,0.5 | smd 1 x 1.9: P$21 4.32,-3.7; P$22 -4.32,-3.7 | smd 0.6 x 1.15: P$A1B12 -3.2,1.075; P$A4B9 -2.4,1.075; P$B1A12 3.2,1.075; P$B4A9 2.4,1.075 | smd 0.3 x 1.15: P$A5 -1.25,1.075; P$A6 -0.25,1.075; P$A7 0.25,1.075; P$A8 1.25,1.075; P$B5 1.75,1.075; P$B6 0.75,1.075; P$B7 -0.75,1.075; P$B8 -1.75,1.075 | hole 0.65: 2.89,0; -2.89,0
MODULESX1276 = smd 2.184 x 1.067: SX1 -8,9.5; SX2 -8,7.5; SX3 -8,5.5; SX4 -8,3.5; SX5 -8,1.5; SX6 -8,-0.5; SX7 -8,-2.5; SX8 -8,-4.5; SX9 8,9.5; SX10 8,7.5; SX11 8,5.5; SX12 8,3.5; SX13 8,1.5; SX14 8,-0.5; SX15 8,-2.5; SX16 8,-4.5
RESC0603_M = smd 1.25 x 1: 1 -0.9,0; 2 0.9,0
52745-2490 = smd 0.3 x 0.8: 1 -5.75,2.5; 2 -5.25,2.5; 3 -4.75,2.5; 4 -4.25,2.5; 5 -3.75,2.5; 6 -3.25,2.5; 7 -2.75,2.5; 8 -2.25,2.5; 9 -1.75,2.5; 10 -1.25,2.5; 11 -0.75,2.5; 12 -0.25,2.5; 13 0.25,2.5; 14 0.75,2.5; 15 1.25,2.5; 16 1.75,2.5; 17 2.25,2.5; 18 2.75,2.5; 19 3.25,2.5; 20 3.75,2.5; 21 4.25,2.5; 22 4.75,2.5; 23 5.25,2.5; 24 5.75,2.5
53261-03 = smd 0.8 x 2: 1 1.25,-2.5; 2 0,-2.5; 3 -1.25,-2.5 | smd 2.1 x 3: S1 3.75,0.625; S2 -3.75,0.625
5.0X3.2_2 = smd 1.7 x 3.3: 1 -1.85,0; 2 1.85,0
XTAL_FC-135_32.7680KA-A0 = smd 1 x 1.8: 1 -1.25,0; 2 1.25,0

### Placement (x,y rotation side)
AC1  15.25,36.99 90 top
BAT  5.71,67.53 90 top
C1  10,73.65 0 top
C2  43.08,55.12 180 top
C3  21.47,22.56 180 top
C4  19.47,38.05 270 top
C5  33.05,60.53 0 top
C6  29.7,60.57 180 top
C7  38.99,59.04 0 top
C8  35.79,59.03 180 top
C9  3.97,6.97 270 top
C10  5.7,6.97 270 top
C11  15.24,64.84 0 top
C12  15.49,67.3 270 top
C13  7.43,6.97 270 top
C14  14.24,40.94 180 top
C15  9.16,6.97 270 top
C16  10.89,6.97 270 top
C17  15.72,76.08 180 top
C18  11.2,70.78 180 top
C19  12.03,12.12 0 top
C20  12.03,10.35 0 top
C21  20.51,10.88 180 top
C22  23.72,10.86 0 top
C23  35.05,8.93 270 top
C24  33.32,8.93 270 top
C25  22.7,64.7 0 top
C31  34.5,37.5 0 top
C32  21,41 90 top
C33  4.3,1.6 180 top
C34  39,61.5 180 top
C35  40,37 180 top
C36  20,54.1 180 top
C37  6,36 0 top
C38  17.5,41 0 top
C39  10,36 0 top
C40  36.5,39 0 top
C41  22.5,41 270 top
C42  22,50 90 top
C43  25.1,55.1 90 top
C44  37.5,51.5 90 top
C45  26,68.5 270 top
D1  24.07,12.95 180 top
D2  16.26,12.15 180 top
D3  22.05,15.09 0 top
D4  20,58 0 top
D5  39.5,8.5 180 top
HM13  12.97,22.44 90 top
J1  42.9,74.5 0 top
J2  44.1,5.2 90 top
J3  3,41 180 top
L1  22.15,18.54 0 top
LED1  9.13,84.41 270 top
LED2  6.43,84.39 90 top
LED3  45.04,49.96 180 top
Q1  28.76,12.4 90 top
Q2  18.89,66.59 180 top
R1  14.45,71.69 270 top
R2  42.09,49.45 0 top
R3  34.27,11.63 180 top
R4  34.27,13.87 180 top
R5  28,27.5 180 top
R6  20,60.1 0 top
R7  39,15.5 0 top
R8  42.1,79.6 180 top
R9  42,71 180 top
R11  28,25.5 180 top
R12  8.71,39.67 180 top
R13  10.72,42.07 180 top
R14  28,23.5 180 top
R15  28,21.5 180 top
R16  28,19.5 180 top
R17  22.9,80.3 90 top
R18  9,81.5 270 top
R19  8.5,1.7 0 top
R20  4.3,3.3 0 top
R21  39,63.5 180 top
R22  21.53,76.08 180 top
R23  6.19,81.66 270 top
R24  10k  [R0603']  18.39,69.4 0 top
R25  40,35 180 top
R26  20,55.9 180 top
R27  6,34 0 top
REG1  12.3,67.07 270 top
RESET  44.39,56.38 90 top
S1  8.5,2.5 180 bottom
S2  44,59 90 bottom
S3  44,33.5 90 bottom
S4  2,59 90 bottom
S5  2,33.5 270 bottom
SD1  38.95,24.76 270 top
T1  39,12.5 180 top
U1  10.06,33.71 0 top
U3  21.26,72.5 180 top
U4  33.4,74.9 0 top
U$1  29.98,46.28 180 top
U$2  16.5,80.19 180 top
U$4  11.5,53.5 90 top
U$27  42.6,77.3 180 top
X1  22.64,6.65 0 top
X3  43,42.6 270 top
Y1  31.11,56.85 0 top
Y2  37.72,56.35 0 top

### Tracks (layer width: path | path; a pad name or v marks a point on that pad's centre or on a via)
BOOT0  (via drill 0.35)
  Top 0.203: v37,48 36.25,48 36.3,48.03 U$1.60 | v34.5,49.12 34.38,49.25 33.45,49.12 v29.25,49.12 | v23.77,55 21.71,57.07 21.71,58.43 21.03,59.1 19.2,59.1 | 19.2,59.1 19.15,59.15 R6.1 | 19.2,59.1 18.9,58.8 D4.C
  Bottom 0.203: v37,48 35.88,49.12 v34.5,49.12 | v29.25,49.12 24.35,54.02 23.73,54.77 v23.77,55
BT_RX  (via drill 0.35)
  Top 0.203: U$1.29 20.16,44.03 v20,43.88 | v20,27.75 11.5,19.25 11.5,15.5 HM13.UART_RX
  Bottom 0.203: v20,27.75 v20,43.88
BT_TX  (via drill 0.35)
  Top 0.203: v19.12,42.88 20.25,42.88 20.88,43.5 23.2,43.5 23.31,43.53 U$1.30 | v18.75,27.75 18.75,27.12 8.5,16.88 8.5,15.5 HM13.UART_TX
  Bottom 0.203: v19.12,42.88 19.5,42.5 19.5,28.5 v18.75,27.75
BUZZER_PWM
  Top 0.203: U$1.41 30.23,38.65 34.12,34.75 34.17,34.75 34.18,34.74 37.47,34.74 42.21,30.01 43.09,30.01 44.55,28.55 44.55,25.7 38.15,19.3 R7.1
CANCEL  (via drill 0.35)
  Top 0.203: C35.1 40.88,35 R25.1 | C35.1 v42.38,36.75 | C35.1 40.88,39.38 42.7,41.2 42.7,44 41.8,44.9 40,44.9 38.87,46.03 U$1.56
  Bottom 0.203: v42.38,36.75 44,36.75 S3.2
CMD  (via drill 0.35)
  Top 0.203: v34.5,45 35.12,45 35.23,45.03 U$1.54 | v33.62,33.38 35.38,31.62 35.38,26.25 33.88,24.76 SD1.3 30.11,24.76 R14.1
  Bottom 0.203: v34.5,45 33.62,44.12 v33.62,33.38
DAT0
  Top 0.203: R15.1 28.88,21.5 30,20.38 31.25,20.38 SD1.7 31.38,20.38 31.39,20.36 37.06,20.36 40.48,23.77 40.48,27.95 34.23,34.2 29.8,34.2 29.23,34.77 U$1.39
DAT1  (via drill 0.35)
  Top 0.203: U$1.40 29.73,35.12 v30.12,35.12 | v32.75,19.4 32.73,19.38 31.38,19.38 SD1.8 31.25,19.38 29,19.38 28.88,19.5 R16.1
  Bottom 0.203: v30.12,35.12 32.75,32.5 v32.75,19.4
DAT2  (via drill 0.35)
  Top 0.203: v37,43.5 36.97,43.53 U$1.51 | R5.1 28.88,27.5 29.38,27 31.25,27 SD1.1 33.36,26.96 34.5,28.1 v34.5,31.25
  Bottom 0.203: v37,43.5 35,41.5 35,31.75 v34.5,31.25
DAT3  (via drill 0.35)
  Top 0.203: v34.5,43.62 34.88,44 35.12,44 35.23,44.03 U$1.52 | SD1.2 31.25,25.75 31.2,25.7 29.05,25.7 R11.1 28.85,26.02 28.04,26.82 28.04,28.18 30.37,30.5 33.03,30.5 33.21,30.68 33.21,31.71 v33.62,32.12
  Bottom 0.203: v34.5,43.62 34.5,33 v33.62,32.12
E_BUSY  (via drill 0.35)
  Top 0.203: v26.5,10.75 25.75,10 24.76,10 24.43,9.68 24.43,9.19 X1.16 | v26.77,37.58 28.24,39.04 28.24,40.02 28.23,40.03 U$1.37
  Bottom 0.203: v26.5,10.75 26.77,11.03 v26.77,37.58
E_DC  (via drill 0.35)
  Top 0.203: v23.62,34.62 24.93,34.62 28.74,38.44 28.74,40.52 U$1.38 | X1.14 23.38,9.25 23.38,9.9 23.49,10.01 23.5,10.01 23.68,10.19 23.68,12.82 v23.6,12.9
  Bottom 0.203: v23.62,34.62 23.62,12.93 v23.6,12.9
E_MOSI  (via drill 0.35)
  Top 0.203: v21.12,47.38 21.5,47 23.41,47 23.52,47.03 U$1.23 | X1.11 21.89,7.49 v22.5,6.88
  Bottom 0.203: v22.5,6.88 21.12,8.25 v21.12,47.38
E_RST  (via drill 0.35)
  Top 0.203: v24.5,8 23.88,8 23.88,9.12 X1.15 | v23.62,35.88 24.01,35.88 27.73,39.59 U$1.36
  Bottom 0.203: v23.62,35.88 24.5,35 v24.5,8
E_SCK  (via drill 0.35)
  Top 0.203: v22.38,47.88 22.5,48 23.62,48 23.73,48.03 U$1.21 | X1.12 22.39,8.14 23.32,7.21 23.32,6.06 v23.5,5.88
  Bottom 0.203: v23.5,5.88 23.5,7 22.5,8 22.5,47.75 v22.38,47.88
E_SPI_CS  (via drill 0.35)
  Top 0.203: v25.38,7.12 24.12,7.12 22.88,8.38 22.88,9.12 X1.13 | v23.62,37.12 24.57,37.12 27.23,39.78 U$1.35
  Bottom 0.203: v25.38,7.12 25.38,35.38 v23.62,37.12
GDR
  Top 0.203: X1.23 27.93,9.19 27.93,9.68 29.71,11.45 Q1.1
  Top 0.254: R3.2 33.24,11.45 Q1.1
GEN_IO  (via drill 0.35)
  Top 0.203: v5.12,57.25 12.62,49.75 20,49.75 20.25,50 23.32,50 23.43,50.03 U$1.17 | v3.38,59 3.38,60 3,60.38 3,62.8 2.8,63 2.8,72.1 5.5,74.8 5.5,78.5 4,80 4,84 5.3,85.3 8.82,85.3 9.17,84.95 9.17,83.88 9.35,83.7 9.8,83.7 11.88,81.62 13.75,81.62 15.25,80.12 U$2.P$A8 15.3,79.08 15.3,78.42 15.48,78.24 15.9,78.24 16.31,77.83 17.62,77.83 18.21,78.42 18.21,79.08 U$2.P$B8
  Bottom 0.203: v3.38,59 v5.12,57.25
GND  (via drill 0.35)
  Top 0.203: U$2.P$B1A12 13.25,79.12 12.75,79.62 12.25,79.62 U$2.P$20 11.99,79.5 v10.5,79.5 | 31.37,21.5 SD1.6 31.36,21.49 v36.1,21.49 | C44.2 38.88,52.38 39,52.5 v39,52 | RESET.P$4 41.28,62.28 41,62 | U$1.18 25.03,49.53 25.5,50 24,51.5 v23.5,51.5 | R26.2 14.1,55.9 v14,56 | AC1.1 13.99,34.16 14.72,33.44 v15.5,33.44 | BAT.2 8.21,65.22 8,65 | C31.2 35.38,36.12 35.53,35.97 v35.93,35.97 | R25.2 38,35 38,35.29 v37.9,35.39 | C35.2 v37.92,37.01 | U1.1 11.09,35.79 C39.2 | U1.7 8.04,34.03 8,34 7.97,34.03 v7.97,35 | C38.2 17.5,41 17.46,41.04 17.46,41.67 17,42.12 v17,42.25 | 12.69,67.89 12.69,68.42 12.87,68.6 13.4,68.6 13.6,68.8 v13.6,69.2 13.27,69.2 | 7.6,70 8.2,70 | 9,70.8 10.23,70.8 C18.2 | C12.2 14.7,66.42 v14.1,67.03 | C9.1 3.97,8.63 3.9,8.7 3.94,8.74 6.29,8.74 7.65,10.1 v8.3,10.1 | X3.3 39.35,43.85 v38.4,44.8 | C2.2 41.06,55.12 v40.18,56 39.78,56.41 | C7.1 38.12,60.09 38.1,60.1 36.3,60.1 36.2,60.2 36.5,60.5 v36.5,61.5 | 3.42,3.27 R20.1 | C33.2 1.8,1.6 1.7,1.7 1.7,8.1 v2,8.4
  Top 0.254: C45.2 30.12,67.62 v30.5,68
  Bottom 0.203: v36.1,21.49 34.41,19.8 v34.41,17.09 32.05,14.73 v32.03,14.73 | v39,52 39,54.82 v40.18,56 | v23.5,51.5 22.36,52.64 v22.36,53.86 | v14,56 14,59 | v10.5,79.5 10,79 | 10.5,81.5 12.5,81.5 v14,83 | 8,65 2.5,65 | v7.97,35 7.97,36.97 v9,38 | 12.83,68.3 12.37,68.3 | v8.3,10.1 8.4,10.1 8.4,3.17 6.63,1.39 | 35.7,49.6 35.77,49.53 36.51,49.53 38.4,47.64 v38.4,44.8 | 18.34,40.94 18.4,41 18,41 | v2,8.4 3.7,8.4 4,8.1
  other vias: 16.01,59.51 10,75.5
  pour Top: 0,2.5 2.5,0 14,0 15,1.5 30,1.5 31,0 34.5,0 34.5,3.4 40.5,3.4 40.5,0 43.5,0 46,2.5 46,82 42,86 4,86 0,82
  pour Bottom: 0,2.5 2.5,0 14,0 15,1.5 30,1.5 31,0 34.5,0 34.5,3.4 40.5,3.4 40.5,0 43.5,0 46,2.5 46,82 42,86 4,86 0,82
GPS_RX  (via drill 0.35)
  Top 0.203: v32.75,46.62 31,44.88 28.88,44.88 28.5,44.5 28.5,43.62 30.75,41.38 30.75,40.62 U$1.42 | U4.3 v32.79,76.51 v32.8,76.5
  Bottom 0.203: v32.75,46.62 33.62,47.5 33.62,51.12 35.75,53.25 35.75,73.55 v32.8,76.5
GPS_TX  (via drill 0.35)
  Top 0.203: v31.62,43.12 31.25,43.12 31.25,40.62 U$1.43 | v31.5,77.5 28.43,77.5 U4.2
  Bottom 0.203: v31.62,43.12 31.62,77.38 v31.5,77.5
LED_PIN
  Top 0.203: R2.1 40.82,49.03 U$1.62
LIPO_BAT  (via drill 0.35)
  Top 0.203: 10,68.02 10,66.76 10.27,66.49 10.63,66.49 REG1.3 | v23.62,71.12 22.12,71.12 U3.8 | 20.26,70.84 20.38,70.62 20.38,69 20.62,68.75 20.62,68.12 21.12,67.62 21.88,67.62 v23.62,69.38 23.95,69.7 24.2,69.7 26.5,72 26.5,72.9 26.81,73.21 U4.6 29.7,73.2 32.75,70.15 v32.75,67.12 | v34.38,53.12 33.75,53.12 33.75,52.12 U$1.1
  Top 0.305: 20.26,70.84 U3.5
  Top 0.406: R1.2 12.21,70.84 C18.1 12.15,70.7 11,69.55 REG1.1 | 8.35,68.02 BAT.1
  Top 0.508: REG1.1 10,68.02 8.35,68.02 | R1.2 20.26,70.84
  Bottom 0.203: v23.62,69.38 v23.62,71.12 | v34.38,53.12 32.75,54.75 v32.75,67.12
N$2
  Top 0.203: 6.19,83.08 R23.1
  Top 0.305: LED2.A 7.5,84.39 | 7.5,84.39 8.36,84.39 LED1.A | 7.5,84.39 6.19,83.08
N$3
  Top 0.203: U3.7 21.5,71 21.5,70.25 24,70.25 24.62,70.88 24.62,81.88 24.04,82.46 20.67,82.46 17.98,85.15 11.85,85.15 10.65,85.15 10,84.5 LED1.C
N$4  (via drill 0.35)
  Top 0.203: LED2.C 5.68,83.48 5.33,83.14 5.33,80.18 7.69,77.83 11.17,77.83 v12.5,76.5 | U3.6 21.01,68.99 v21.5,68.5
  Bottom 0.203: v12.5,76.5 20.5,68.5 v21.5,68.5
N$5
  Top 0.203: C1.+ 13.34,73.65 R1.1
N$6
  Top 0.203: REG1.4 13.6,65.77 14.37,65
  Top 0.406: 14.37,65 C11.1
N$9
  Top 0.203: U$27.1 43.5,73.55 J1.3
  Top 0.61: R9.1 arc90 42.9,71.05
  Top 1.016: 42.9,71.05 J1.3
N$11
  Top 0.203: LED3.C 43.18,49.21 R2.2
N$18
  Top 0.203: L1.2 24,17.94 24,15.19 D3.A 24.59,14.4 C22.2 25.46,10.86 27,12.4 Q1.3
N$22  (via drill 0.35)
  Top 0.203: R19.2 9.4,1.75 v9.4,2.9
  Bottom 0.203: v9.4,2.9 11.25,2.9 S1.2
N$23
  Top 0.203: U$27.2 41.7,78.35 R8.1
N$24
  Top 0.203: C22.1 22.22,11.48 D1.A 20.62,12.95 19.82,12.15 D2.C
N$25
  Top 1.016: J3.3 2,43.55 U$4.SX1
N$26
  Top 0.406: T1.3 41.35,9.13 D5.C 42.11,7.74 J2.2
N$28
  Top 0.203: T1.1 39.89,15.46 R7.2
N$30
  Top 0.203: AC1.10 19.38,37.27 C4.2
N$31
  Top 0.203: U4.14 38.81,74.31 40,75.5 40,78.9 40.7,79.6 R8.2
N$32
  Top 0.254: U3.2 21.51,75.25 R22.2
N$33
  Top 0.203: AC1.20 13.14,37.74 12.71,37.74 12.35,38.1 12.35,39.93 C14.2
N$36
  Top 0.61: U4.11 arc90 U4.11 arc-90 U4.11
  Top 0.7: U4.11 R9.2
N$55
  Top 0.203: U$1.31 22.16,43.03 C32.2
N$74
  Top 0.203: U$1.47 33.23,37.9 C31.1
N$93
  Top 0.203: R17.2 19.12,81.15 17.8,79.82 17.8,79.16 U$2.P$A5
N$99
  Top 0.203: R18.2 11.4,80.65 11.85,81.1 13.67,81.1 14.75,80.02 14.75,79.41 U$2.P$B5
NEXT  (via drill 0.35)
  Top 0.203: U$1.27 20.09,45.03 v20,45.12 | 20.88,55.9 C36.1 20.88,54.08 19.4,52.6 19.4,50.85 v19.62,50.62 | 20.88,55.9 R26.1 | v6.18,58.05 7.11,57.12 20,57.12 | 20,57.12 20.88,56.25 20.88,55.9 | 20,57.12 20.88,58 D4.A
  Bottom 0.203: v20,45.12 19.62,45.5 v19.62,50.62 | v6.18,58.05 2.08,62.15 S4.2
OK  (via drill 0.35)
  Top 0.203: v25.5,44.5 25.45,44.5 25.5,44.53 U$1.28 | v28.38,35.62 24.75,32 7.25,32 5.25,34 R27.1 | C37.1 5.12,34 R27.1 | v5.38,32.42 5.38,33.75 R27.1
  Bottom 0.203: v25.5,44.5 27.12,42.88 27.12,38.88 27.55,38.45 27.55,37.3 27.5,37.25 27.5,36.5 v28.38,35.62 | v5.38,32.42 2,30.38 S5.2
PC14
  Top 0.203: U$1.3 32.73,52.77 34.11,54.15 37.15,54.15 38.97,55.97 Y2.2 38.97,58.15 C7.2
PC15
  Top 0.203: U$1.4 32.23,52.93 35.65,56.35 Y2.1 36.47,57.48 C8.2
PH0
  Top 0.203: C5.2 33.92,60.42 32.96,59.46 Y1.2 32.35,56.85 31.73,56.23 U$1.5
PH1
  Top 0.203: C6.2 29.26,60.13 Y1.1 31.23,54.88 U$1.6
PREV  (via drill 0.35)
  Top 0.203: R21.1 39.85,61.52 C34.1 40.94,61.5 41.46,60.97 42.39,60.97 v43.09,60.27 | U$1.57 36.3,46.53 36.25,46.5 39.88,46.5 42.12,48.75 42.12,51.25 v40,53.38
  Bottom 0.203: S2.2 44,61.18 v43.09,60.27 43.09,59.59 42.5,59 42.5,55.88 v40,53.38
PREVGH
  Top 0.203: C15.2 9.19,6.06 9.19,5.79 10.1,4.88 15.94,4.88 18.39,7.34 X1.4 18.39,10.29 16.9,11.78 16.9,12.43 19.58,15.11 20.23,15.11 D3.C
PREVGL
  Top 0.203: C19.2 12.94,12.15 D2.A 15.01,12.15 17.39,9.78 X1.2
PWREN
  Top 0.203: R24.2 19.78,68.77 Q2.1 18.63,66.45 18.26,66.45 18.08,66.27 18.08,64.88 18.1,64.86 18.1,64.7 18.39,64.41 21.72,64.41 21.82,64.3 | U$1.9 29.73,52.73 27.95,54.51 27.41,54.51 26.92,55 26.92,57.94 21.82,63.03 21.82,64.3 | 21.82,64.3 C25.1
RESE
  Top 0.203: X1.22 27.43,9.19 27.43,9.75 28.85,11.17 28.85,12.08 29.86,13.08 Q1.2
  Top 0.254: Q1.2 30.38,13.87 R4.2
RESET
  Top 0.203: RESET.P$3 44,62.25 45.62,60.62 45.62,57.5 44,57.5 RESET.P$1 43.89,55.19 C2.1 43.88,55 43.12,54.25 37.88,54.25 34.73,51.1 30.9,51.1 30.73,51.27 U$1.7
SCL1  (via drill 0.35)
  Top 0.203: U1.4 11.14,32.67 12.05,32.67 v12.25,32.88 | AC1.23 13.12,36.25 11.88,36.25 v11.88,37.12 11.88,42 | 11.88,42 11.62,42 R13.1 | U$1.61 35.23,48.53 35.12,48.5 34.62,48 30.38,48 26.83,44.46 26.83,43.44 25.27,41.88 24.12,41.88 23.25,41 19.88,41 18.94,41.94 18.47,41.94 17.34,43.07 15.66,43.07 14.53,41.94 11.7,41.94 R13.1 | 11.88,42 R13.1
  Bottom 0.203: v12.25,32.88 11.88,33.25 v11.88,37.12
SDA1  (via drill 0.35)
  Top 0.203: 12.94,34.81 13.12,35 13.12,35.62 AC1.24 | 12.94,34.81 12.56,34.44 | 12.56,34.44 11.53,33.4 11.09,33.4 U1.3 | v28,41.75 28,45 30.5,47.5 35.12,47.5 35.23,47.53 U$1.59 | v28.38,36.88 25.25,33.75 16.97,33.75 15.84,32.62 14.38,32.62 12.56,34.44 | v11,39.25 9.85,39.25 R12.1 | v12.88,34.88 12.94,34.81
  Bottom 0.203: v28,41.75 28.38,41.38 v28.38,36.88 | v11,39.25 12.88,37.38 v12.88,34.88
SDCARD  (via drill 0.35)
  Top 0.203: U$1.50 35.16,43.03 34.88,42.75 34.88,39.88 36.25,39.88 36.5,39.62 36.5,37 v36.62,37 | v37.12,33.88 37.77,33.88 42.04,29.6 42.92,29.6 43.95,28.57 43.95,26.05 36.06,18.16 SD1.9
  Bottom 0.203: v36.62,37 37.12,36.5 v37.12,33.88
SDCK  (via drill 0.35)
  Top 0.203: U$1.53 37.22,44.53 v38.38,43.38 | v38.92,25.15 36.4,22.62 31.38,22.62 SD1.5
  Bottom 0.203: v38.38,43.38 38.92,42.83 v38.92,25.15
SWCLK
  Top 0.203: U$1.49 X3.2
SWDIO
  Top 0.203: U$1.46 32.73,36.77 34.35,35.15 36.27,35.15 37.27,36.15 39.78,36.15 40.04,36.42 40.04,37.67 40.18,37.81 40.2,41.05 X3.1
SX_INT
  Top 0.203: U$1.25 19.16,46.03 16.82,43.7 12.57,43.7 12,44.27 U$4.SX6
SX_MISO
  Top 0.203: U$1.10 29.23,52.65 27.78,54.1 27.21,54.1 26.51,54.8 26.51,57.77 20.78,63.5 15,63.5 14,62.5
  Top 0.406: U$4.SX15 14,62.5
SX_MOSI
  Top 0.203: U$1.11 28.75,52.05 28.75,52.56 27.61,53.69 27.01,53.69 26.1,54.6 26.1,57.5 20.7,62.9 15.34,62.9 14.84,62.4 14.84,60.28 14.66,60.1 13.34,60.1 13.16,60.28 13.16,60.34 U$4.SX14
SX_NSS
  Top 0.203: U$1.24 17.72,46.53 15.62,48.62 9,48.62 4.25,53.38 4.25,57.41 5.42,58.58 5.45,58.61 8,61.16 U$4.SX12
SX_RST  (via drill 0.35)
  Top 0.203: U$1.26 24.73,45.53 24.74,45.52 25.07,45.52 25.5,45.95 v25.5,47.5 | v16.38,58 9.5,58 8.84,58.66 8.84,62.72 8.66,62.9 7.5,62.9 7.34,62.9 7.16,62.72 7.16,62.56 6.1,61.5 U$4.SX11
  Bottom 0.203: v25.5,47.5 21.38,51.62 21.38,53 v16.38,58
SX_SCK  (via drill 0.35)
  Top 0.203: v18,34.88 20.15,34.88 23.15,37.88 24.68,37.88 26.73,39.93 U$1.34 | U$4.SX13 v10,59.5
  Bottom 0.203: v18,34.88 8.38,44.5 8.38,57.88 v10,59.5
SYS_WKUP  (via drill 0.35)
  Top 0.203: v20.5,52.62 20.75,52.88 26.93,52.88 27.15,52.66 27.15,52.65 27.23,52.57 U$1.14 | 5.25,1.75 5.25,3.25 R20.2 5.15,3.42 3.12,5.44 3.12,8.62 6.21,11.71 6.21,29.04 2.89,32.36 2.89,37.05 3.96,38.12 5.5,38.12 7.05,39.68 7.05,41.08 9.16,43.18 9.16,46.72 9.34,46.9 12.15,46.9 v13,47.75 | 5.25,1.75 5.25,1.62 C33.1 5.25,1.75 | 5.25,1.75 7.62,1.75 R19.1
  Bottom 0.203: v20.5,52.62 19.38,51.5 13,51.5 v13,47.75
USB5V
  Top 0.203: U$2.P$B4A9 13.91,78.93 13.91,78.42 13.73,78.24 8.76,78.24 R23.2 | U3.4 20.5,73.88 20.45,73.97
  Top 0.406: U$2.P$B4A9 14.2,79.03 14.2,78.38 14.93,77.64 15.59,77.64 16.6,76.62 16.6,76.15 C17.1 18.34,76.08 | 18.34,76.08 20.45,73.97 | U$2.P$A4B9 18.9,76.64 18.34,76.08
USBD+  (via drill 0.35)
  Top 0.203: 16.58,79.95 16.53,80 15.98,80 15.8,79.82 15.8,79.3 15.75,79.26 U$2.P$B6 | 16.58,79.95 16.71,79.82 16.71,79.3 16.75,79.26 U$2.P$A6 | v31.88,39.25 32.25,39.25 32.25,40.5 U$1.45 | v16.62,80.5 16.62,80 16.58,79.95
  Bottom 0.203: v31.88,39.25 26.38,44.75 26.38,51 22.75,54.62 22.75,74.38 v16.62,80.5
USBD-  (via drill 0.35)
  Top 0.203: v32.12,41.75 31.75,41.75 31.75,40.62 U$1.44 | v23.75,72.38 23.75,78.88 24,79.12 24,81.6 23.55,82.05 19.43,82.05 17.25,79.88 U$2.P$B7 17.21,79.08 17.21,78.42 17.03,78.24 16.48,78.24 16.3,78.42 16.3,79.08 U$2.P$A7
  Bottom 0.203: v32.12,41.75 31.62,42.25 30.5,42.25 30.5,65.62 v23.75,72.38
VCC3V3  (via drill 0.35)
  Top 0.203: X1.10 21.38,9.25 21.38,10.85 C21.1 | AC1.9 17.38,36.62 17.38,36.25 AC1.8 | C38.1 16.52,40.9 16.52,39.12 16.62,39.12 | v18.62,36 18.38,36.25 | 16.62,39.12 v17.5,39.12 | 16.62,39.12 AC1.13 | 9.12,34.75 U1.8 9.12,34.62 10.12,34.62 10.69,34.06 10.62,34 | 10.62,34 10.03,33.4 9.05,33.4 U1.6 | 10.62,34 11,34 U1.2 | 9.75,42 R13.2 9.88,42.12 10,42.12 | 13.62,43 v13.75,42.88 | 19,65.62 Q2.3 | 27.25,19.5 R16.2 | 27.25,27.5 R5.2 27.12,27.5 | 27.25,25.5 R11.2 | 27.25,21.5 R15.2 | 27.25,23.5 R14.2 | 31.38,23.62 SD1.4 | 17.57,29.93 17.57,29.05 HM13.VCC | 40.25,66.25 v40.4,66.1
  Top 0.254: C39.1 9.12,34.75 | U4.8 27.04,71.01 26,69.97 C45.1 22.9,66.28 22.9,66.25
  Top 0.305: 18.38,36.25 17.38,36.25 | 9.75,42 8.62,42 7.86,41.23 R12.2 8.06,39.47 8.06,37.06 | 10,42.12 10,43 | 10,43 U$4.SX5 | 10,43 13.62,43 | 17.77,29.93 24.7,29.93 27.12,27.5 | 17.77,29.93 17.57,29.93 | R16.2 26.95,19.3 25.89,19.3 24.3,20.9 22.7,20.9 20.9,19.09 L1.1 20.9,22.25 C3.2 | 17.77,29.93 16.7,31 4.9,31 3.62,32.27 v3.62,36.75 4.54,37.67 7.46,37.67 8.06,37.06 | 32.1,15.72 32.08,15.7 | 36.5,15 36.5,7.67 36,7.17 34.59,7.17 31.79,4.38 22.32,4.38 20.89,5.81 X1.9 X1.10 | 8.06,37.06 C39.1 | 37.98,13.52 T1.2
  Top 0.406: 19,65.62 19.62,66.25 22.9,66.25 40.25,66.25 | 27.25,19.5 27.25,21.5 27.25,22.49 | 27.25,27.5 27.25,25.5 27.25,23.5 27.25,22.49 | v39.73,27.6 36.25,23.62 31.38,23.62 | 26.95,19.3 30.55,15.7 32.08,15.7 | 32.1,15.72 35.78,15.72 36.5,15 37.98,13.52 | SD1.4 30.66,23.66 29.5,22.49 27.25,22.49
  Bottom 0.203: v3.62,36.75 2,36.75 S5.1 | 44.62,55.12 44,55.75 S2.1 | 44.62,54 v44.75,53.88 44.62,53.88 | 43.45,29.7 44,30.25 S3.1
  Bottom 0.305: v18.62,36 17.5,37.12 v17.5,39.12 v13.75,42.88
  Bottom 0.406: 44.62,54 44.62,55.12 | 44.62,53.88 41.5,50.75 41.5,33 44,30.5 S3.1 | S2.1 44,58.17 45.25,59.42 45.25,63.79 44.43,64.61 41.89,64.61 v40.4,66.1 | 43.45,29.7 41.65,29.7 v39.73,27.6
VCCR3V3  (via drill 0.35)
  Top 0.203: R24.1 17.75,69.38 17.75,67.62 18,67.62 Q2.2 | C41.1 23.12,42.5 23.23,42.53 U$1.32 | 24.78,49.02 24.77,49.03 24.4,49.03 U$1.19 | 27.74,52.02 U$1.13 27.75,52.12 27.75,52.13 27.75,52.63 27.1,53.28 26.04,53.28 C43.1 | 33.75,40.62 U$1.48 33.73,39.87 34.3,39.3 35.33,39.3 C40.1 | C44.1 39.52,50.62 v40.2,51.3 | LED3.A 42.45,53.3 v42.4,53.3
  Top 0.254: U$1.64 36.91,50.03 C44.1 | 25.27,49.02 24.78,49.02 | 27.74,52.02 27.74,50.69 | 25.28,42.53 U$1.32 | 32.75,43.25 33.75,42.25 33.75,40.62 | 22.9,49.02 24.39,49.02 24.4,49.03
  Top 0.305: 27.74,50.69 26.38,49.33 | 25.27,49.02 25.62,49.38 26.38,49.38 26.38,49.33 | 25.28,42.53 26.38,43.62 26.38,46.12 | 26.38,49.33 26.38,46.12 | 32.75,43.25 32,44 v29.38,44 | 26.38,46.12 v27.25,46.12 28.43,47.31 28.43,49.46 29,50.03 U$1.64 | C12.1 15.34,68.02
  Top 0.406: v5.12,55.75 5.22,55.75 11.75,49.23 21.9,49.23 C42.1 22.8,49.12 22.9,49.02 | v12.3,64.3 12.3,66.72 REG1.5 15.34,68.02 | C12.1 17.44,68.17 Q2.2
  Bottom 0.203: 2.5,55.75 2,55.75 S4.1 2.5,55.75 | 2.5,55.75 2.5,54.25 6.5,50.25 6.5,3.62 5.38,2.5 S1.1 | v40.2,51.3 42.2,53.3 v42.4,53.3
  Bottom 0.254: v5.12,55.75 2.5,55.75
  Bottom 0.305: v27.25,46.12 v29.38,44
  Bottom 0.406: v12.3,64.3 7.41,59.41 7.41,57.96 5.26,55.81 5.19,55.81 v5.12,55.75
VCOM
  Top 0.203: C20.2 14.11,9.15 X1.1
VDD
  Top 0.203: C9.2 6.4,3.66 16.44,3.66 19.89,7.11 X1.7
VGH
  Top 0.203: X1.20 26.43,9.11 26.43,7.8 29.34,4.88 31.65,4.88 34.82,8.05 C23.2
VGL
  Top 0.203: X1.21 26.93,9.11 26.93,7.87 29.51,5.29 31.32,5.29 33.32,7.3 C24.2
VPP
  Top 0.203: C10.2 7.73,4.07 16.27,4.07 19.39,7.18 X1.6
VSH
  Top 0.203: C13.2 9.05,4.48 16.11,4.48 18.89,7.26 X1.5
VSL
  Top 0.203: X1.3 17.85,9.11 17.85,7.37 15.77,5.29 11.86,5.29 11.69,5.29 C16.2

### Text on the board
tPlace: FreeVarioF4 1.2 | +